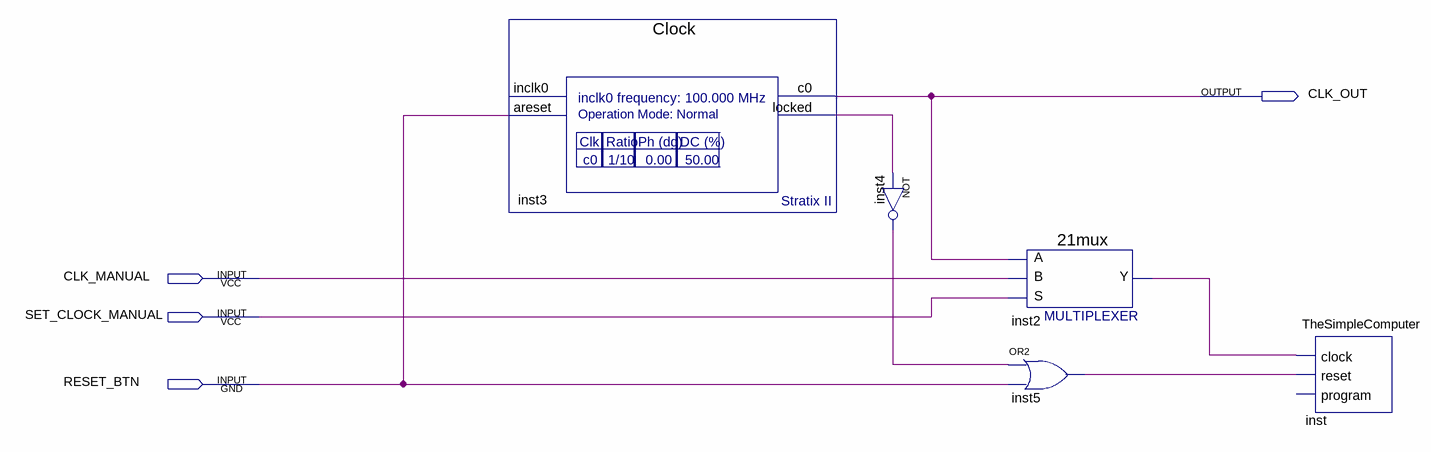
[diagram p0: schematic sheet]
// Quartus schematic VerySimpleComputer.bdf as structural Verilog: 5 symbols, 4 pins
module VerySimpleComputer (
  input  CLK_MANUAL,
  input  SET_CLOCK_MANUAL,
  input  RESET_BTN,
  output CLK_OUT
);

  wire inst2_y, inst3_locked, inst4_out, inst5_out;

  Clock inst3 (.areset(RESET_BTN), .c0(CLK_OUT), .locked(inst3_locked));  // open: inclk0
  not inst4 (inst4_out, inst3_locked);
  \21mux  inst2 (.S(SET_CLOCK_MANUAL), .B(CLK_MANUAL), .A(CLK_OUT), .Y(inst2_y));
  or inst5 (inst5_out, inst4_out, RESET_BTN);
  TheSimpleComputer inst (.clock(inst2_y), .reset(inst5_out));  // open: program
endmodule
